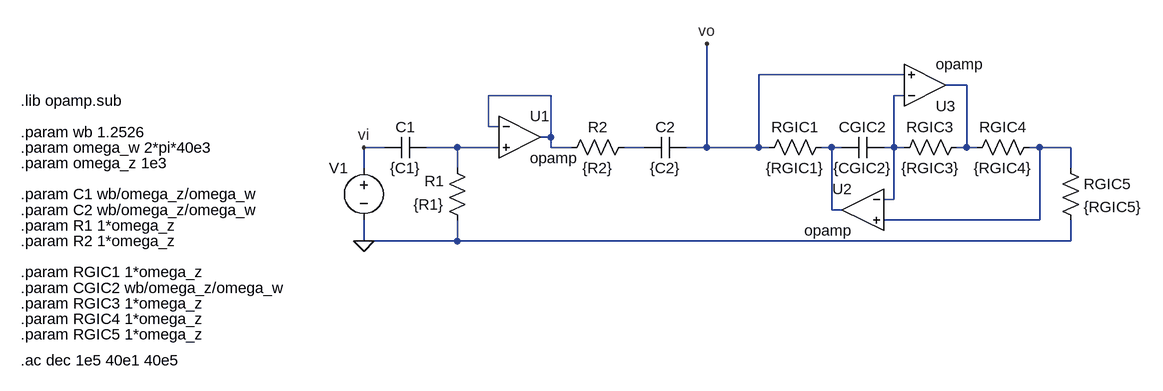
[diagram p0: schematic circ_gic.asc]
circ_gic.asc, the LTspice schematic file:
Version 4
SHEET 1 2444 680
WIRE 2080 80 1856 80
WIRE 2176 96 2144 96
WIRE 1536 112 1440 112
WIRE 2080 112 2064 112
WIRE 1440 160 1440 112
WIRE 1456 160 1440 160
WIRE 1536 176 1536 112
WIRE 1536 176 1520 176
WIRE 1280 192 1248 192
WIRE 1392 192 1344 192
WIRE 1456 192 1392 192
WIRE 1536 192 1536 176
WIRE 1568 192 1536 192
WIRE 1680 192 1648 192
WIRE 1776 192 1776 32
WIRE 1776 192 1744 192
WIRE 1856 192 1856 80
WIRE 1856 192 1776 192
WIRE 1872 192 1856 192
WIRE 1968 192 1952 192
WIRE 1984 192 1968 192
WIRE 2064 192 2064 112
WIRE 2064 192 2048 192
WIRE 2080 192 2064 192
WIRE 2176 192 2176 96
WIRE 2176 192 2160 192
WIRE 2192 192 2176 192
WIRE 2288 192 2272 192
WIRE 2336 192 2288 192
WIRE 1248 224 1248 192
WIRE 1392 224 1392 192
WIRE 2336 224 2336 192
WIRE 2064 272 2064 192
WIRE 2064 272 2048 272
WIRE 1968 288 1968 192
WIRE 1984 288 1968 288
WIRE 2288 304 2288 192
WIRE 2288 304 2048 304
WIRE 1248 336 1248 304
WIRE 1392 336 1392 304
WIRE 1392 336 1248 336
WIRE 2336 336 2336 304
WIRE 2336 336 1392 336
FLAG 1248 336 0
FLAG 1776 32 vo
FLAG 1248 192 vi
SYMBOL res 1408 320 R180
WINDOW 0 36 76 Left 2
WINDOW 3 36 40 Left 2
SYMATTR InstName R1
SYMATTR Value {R1}
SYMBOL cap 1344 176 R90
WINDOW 0 0 32 VBottom 2
WINDOW 3 32 32 VTop 2
SYMATTR InstName C1
SYMATTR Value {C1}
SYMBOL cap 1744 176 R90
WINDOW 0 0 32 VBottom 2
WINDOW 3 32 32 VTop 2
SYMATTR InstName C2
SYMATTR Value {C2}
SYMBOL res 1664 176 R90
WINDOW 0 0 56 VBottom 2
WINDOW 3 32 56 VTop 2
SYMATTR InstName R2
SYMATTR Value {R2}
SYMBOL opamp 1488 112 R0
SYMATTR InstName U1
SYMBOL voltage 1248 208 M0
SYMATTR InstName V1
SYMATTR Value ""
SYMATTR Value2 AC 1
SYMBOL opamp 2016 224 M0
SYMATTR InstName U2
SYMBOL opamp 2112 160 M180
SYMATTR InstName U3
SYMBOL res 1968 176 R90
WINDOW 0 0 56 VBottom 2
WINDOW 3 32 56 VTop 2
SYMATTR InstName RGIC1
SYMATTR Value {RGIC1}
SYMBOL res 2176 176 R90
WINDOW 0 0 56 VBottom 2
WINDOW 3 32 56 VTop 2
SYMATTR InstName RGIC3
SYMATTR Value {RGIC3}
SYMBOL cap 2048 176 R90
WINDOW 0 0 32 VBottom 2
WINDOW 3 32 32 VTop 2
SYMATTR InstName CGIC2
SYMATTR Value {CGIC2}
SYMBOL res 2288 176 R90
WINDOW 0 0 56 VBottom 2
WINDOW 3 32 56 VTop 2
SYMATTR InstName RGIC4
SYMATTR Value {RGIC4}
SYMBOL res 2320 208 R0
SYMATTR InstName RGIC5
SYMATTR Value {RGIC5}
TEXT 720 168 Left 2 !.param wb 1.2526
TEXT 720 120 Left 2 !.lib opamp.sub
TEXT 720 264 Left 2 !.param C1 wb/omega_z/omega_w
TEXT 720 288 Left 2 !.param C2 wb/omega_z/omega_w
TEXT 720 312 Left 2 !.param R1 1*omega_z
TEXT 720 336 Left 2 !.param R2 1*omega_z
TEXT 720 520 Left 2 !.ac dec 1e5 40e1 40e5
TEXT 720 192 Left 2 !.param omega_w 2*pi*40e3
TEXT 720 216 Left 2 !.param omega_z 1e3
TEXT 720 384 Left 2 !.param RGIC1 1*omega_z
TEXT 720 408 Left 2 !.param CGIC2 wb/omega_z/omega_w
TEXT 720 432 Left 2 !.param RGIC3 1*omega_z
TEXT 720 456 Left 2 !.param RGIC4 1*omega_z
TEXT 720 480 Left 2 !.param RGIC5 1*omega_z

The netlist it stands for:
* circ_gic.asc
R1 0 N004 {R1}
C1 N004 vi {C1}
C2 vo N005 {C2}
R2 N005 N002 {R2}
XU1 N002 N004 N002 opamp Aol=100K GBW=10Meg  ; pins invin noninvin out
V1 vi 0 AC 1
XU2 N003 N007 N006 opamp Aol=100K GBW=10Meg  ; pins invin noninvin out
XU3 N003 vo N001 opamp Aol=100K GBW=10Meg  ; pins invin noninvin out
RGIC1 N006 vo {RGIC1}
RGIC3 N001 N003 {RGIC3}
CGIC2 N003 N006 {CGIC2}
RGIC4 N007 N001 {RGIC4}
RGIC5 N007 0 {RGIC5}
.param wb 1.2526
.lib opamp.sub
.param C1 wb/omega_z/omega_w
.param C2 wb/omega_z/omega_w
.param R1 1*omega_z
.param R2 1*omega_z
.ac dec 1e5 40e1 40e5
.param omega_w 2*pi*40e3
.param omega_z 1e3
.param RGIC1 1*omega_z
.param CGIC2 wb/omega_z/omega_w
.param RGIC3 1*omega_z
.param RGIC4 1*omega_z
.param RGIC5 1*omega_z
.backanno
.end